# Altium schematic sheet Connectors_Clone.SchDoc: Connectors
size A3; Date: Not used; ApprovedBy: Not used; CheckedBy: Not used; Author: Not used; CompanyName: STMicroelectronics; DrawnBy: Not used; Engineer: Not used; Organization: Not used; Address1: Not used; Address2: Not used; Address3: Not used; Address4: Not used; DocumentNumber: 5; Revision: Not used; SheetNumber: 5; SheetTotal: 9; CurrentTime: Not used; CurrentDate: Not used; Time: Not used; DocumentFullPathAndName: Not used; DocumentName: Not used; ModifiedDate: Not used; ImagePath: Not used; ProjectName: Not used; Application_BuildNumber: Not used
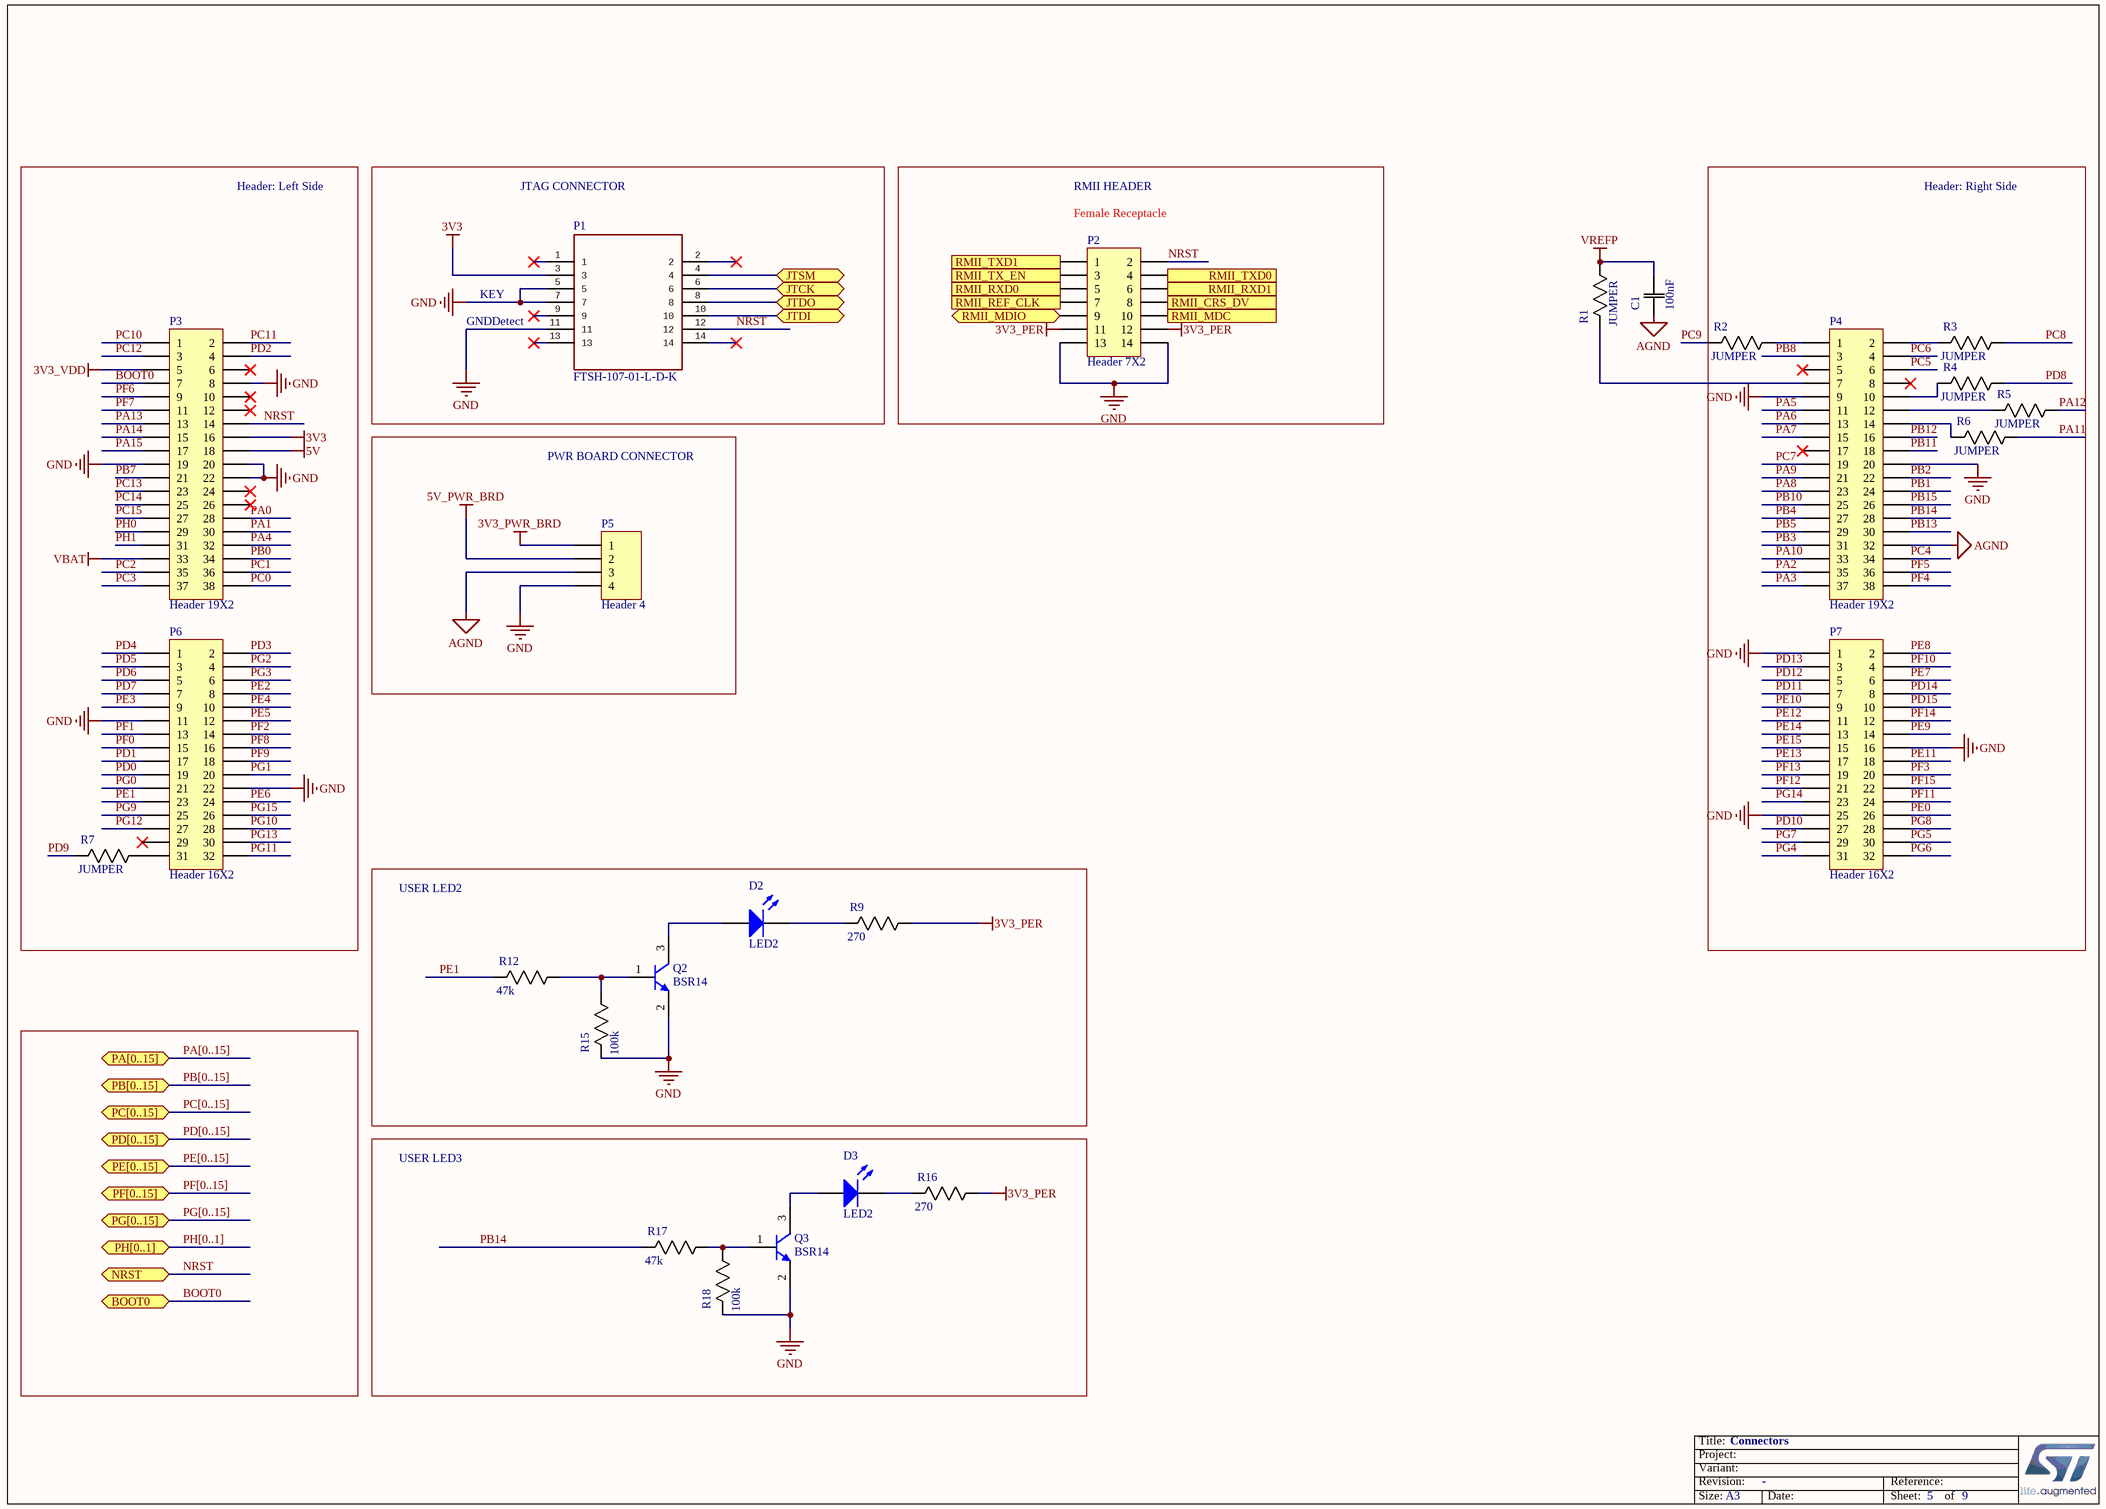
[diagram p0: Connectors_Clone.SchDoc]

## Parts
C1  100nF  [0805]
D2  LED2  [3.2X1.6X1.1]
D3  LED2  [3.2X1.6X1.1]
P1  FTSH-107-01-L-D-K  [CN HDR JTAG]
P2  Header 7X2  [HDR2X7]
P3  Header 19X2  [HDR2X19]
P4  Header 19X2  [HDR2X19]
P5  Header 4  [HDR1X4]
P6  Header 16X2  [HDR2X16]
P7  Header 16X2  [HDR2X16]
Q2  BSR14  [ONSC-SOT-23-3-318-08_V]
Q3  BSR14  [ONSC-SOT-23-3-318-08_V]
R1  JUMPER  [0805]
R2  JUMPER  [0805]
R3  JUMPER  [0805]
R4  JUMPER  [0805]
R5  JUMPER  [0805]
R6  JUMPER  [0805]
R7  JUMPER  [0805]
R9  270  [0805]
R12  47k  [0805]
R15  100k  [0805]
R16  270  [0805]
R17  47k  [0805]
R18  100k  [0805]

## Blocks framed on the sheet
Header: Left Side: P3 P6 R7
Header: Right Side: P4 P7 R2-R6
PWR BOARD CONNECTOR: P5
USER LED2: D2 Q2 R9 R12 R15
USER LED3: D3 Q3 R16-R18

## Ports
BOOT0 (bidir), JTCK (bidir), JTDI (bidir), JTDO (bidir), JTSM (bidir), NRST (bidir), PA[0..15] (bidir), PB[0..15] (bidir), PC[0..15] (bidir), PD[0..15] (bidir), PE[0..15] (bidir), PF[0..15] (bidir), PG[0..15] (bidir), PH[0..1] (bidir), RMII_CRS_DV (out), RMII_MDC (in), RMII_MDIO (bidir), RMII_REF_CLK (in), RMII_RXD0 (out), RMII_RXD1 (out), RMII_TX_EN (in), RMII_TXD0 (in), RMII_TXD1 (in)

## Nets
3V3: P1.3 P3.16
3V3_PER: P2.11 P2.12 R9.1(R1) R16.1(R1)
3V3_PWR_BRD: P5.1
3V3_VDD: P3.5
5V: P3.18
5V_PWR_BRD: P5.2
AGND: C1.1(C1) P4.32 P5.3
GND: P1.5 P1.7 P1.11 P2.13 P2.14 P3.8 P3.19 P3.20 P3.22 P4.9 P4.20 P5.4 P6.11 P6.22 P7.1 P7.16 P7.25 Q2.2(E) Q3.2(E) R15.2(R2) R18.2(R2)
VBAT: P3.33
VREFP: C1.2(C2) R1.1(R1)
BOOT0: P3.7 ; port BOOT0
JTCK: P1.6 ; port JTCK
JTDI: P1.10 ; port JTDI
JTDO: P1.8 ; port JTDO
JTSM: P1.4 ; port JTSM
NRST: P1.12 P2.2 P3.14 ; port NRST
PA0: P3.28
PA1: P3.30
PA2: P4.35
PA3: P4.37
PA4: P3.32
PA5: P4.11
PA6: P4.13
PA7: P4.15
PA8: P4.23
PA9: P4.21
PA10: P4.33
PA11: R6.1(R1)
PA12: R5.1(R1)
PA13: P3.13
PA14: P3.15
PA15: P3.17
PB0: P3.34
PB1: P4.24
PB2: P4.22
PB3: P4.31
PB4: P4.27
PB5: P4.29
PB7: P3.21
PB8: P4.3
PB10: P4.25
PB11: P4.18
PB12: P4.16
PB13: P4.30
PB14: P4.28 R17.2(R2)
PB15: P4.26
PC0: P3.38
PC1: P3.36
PC2: P3.35
PC3: P3.37
PC4: P4.34
PC5: P4.6
PC6: P4.4
PC7: P4.19
PC8: R3.1(R1)
PC9: R2.2(R2)
PC10: P3.1
PC11: P3.2
PC12: P3.3
PC13: P3.23
PC14: P3.25
PC15: P3.27
PD0: P6.19
PD1: P6.17
PD2: P3.4
PD3: P6.2
PD4: P6.1
PD5: P6.3
PD6: P6.5
PD7: P6.7
PD8: R4.1(R1)
PD9: R7.2(R2)
PD10: P7.27
PD11: P7.7
PD12: P7.5
PD13: P7.3
PD14: P7.8
PD15: P7.10
PE0: P7.26
PE1: P6.23 R12.2(R2)
PE2: P6.8
PE3: P6.9
PE4: P6.10
PE5: P6.12
PE6: P6.24
PE7: P7.6
PE8: P7.2
PE9: P7.14
PE10: P7.9
PE11: P7.18
PE12: P7.11
PE13: P7.17
PE14: P7.13
PE15: P7.15
PF0: P6.15
PF1: P6.13
PF2: P6.14
PF3: P7.20
PF4: P4.38
PF5: P4.36
PF6: P3.9
PF7: P3.11
PF8: P6.16
PF9: P6.18
PF10: P7.4
PF11: P7.24
PF12: P7.21
PF13: P7.19
PF14: P7.12
PF15: P7.22
PG0: P6.21
PG1: P6.20
PG2: P6.4
PG3: P6.6
PG4: P7.31
PG5: P7.30
PG6: P7.32
PG7: P7.29
PG8: P7.28
PG9: P6.25
PG10: P6.28
PG11: P6.32
PG12: P6.27
PG13: P6.30
PG14: P7.23
PG15: P6.26
PH0: P3.29
PH1: P3.31
RMII_CRS_DV: P2.8 ; port RMII_CRS_DV
RMII_MDC: P2.10 ; port RMII_MDC
RMII_MDIO: P2.9 ; port RMII_MDIO
RMII_REF_CLK: P2.7 ; port RMII_REF_CLK
RMII_RXD0: P2.5 ; port RMII_RXD0
RMII_RXD1: P2.6 ; port RMII_RXD1
RMII_TX_EN: P2.3 ; port RMII_TX_EN
RMII_TXD0: P2.4 ; port RMII_TXD0
RMII_TXD1: P2.1 ; port RMII_TXD1
NetD2_1: D2.1(A) Q2.3(C)
NetD2_2: D2.2(K) R9.2(R2)
NetD3_1: D3.1(A) Q3.3(C)
NetD3_2: D3.2(K) R16.2(R2)
NetP4_1: P4.1 R2.1(R1)
NetP4_2: P4.2 R3.2(R2)
NetP4_7: P4.7 R1.2(R2)
NetP4_10: P4.10 R4.2(R2)
NetP4_12: P4.12 R5.2(R2)
NetP4_14: P4.14 R6.2(R2)
NetP6_31: P6.31 R7.1(R1)
NetQ2_1: Q2.1(B) R12.1(R1) R15.1(R1)
NetQ3_1: Q3.1(B) R17.1(R1) R18.1(R1)

Not connected (* = marked no-connect by the designer): P1 1* 2* 9* 13* 14*; P3 6* 10* 12* 24* 26*; P4 5* 8* 17*; P6 29*

## Buses and harness runs
bus PA[0..15] = port PA[0..15]
bus PB[0..15] = port PB[0..15]
bus PC[0..15] = port PC[0..15]
bus PD[0..15] = port PD[0..15]
bus PE[0..15] = port PE[0..15]
bus PF[0..15] = port PF[0..15]
bus PG[0..15] = port PG[0..15]
bus PH[0..1] = port PH[0..1]

## Notes on the sheet
- JTAG CONNECTOR
- RMII HEADER
- (near P2) Female Receptacle
- KEY
- (near P1) GNDDetect
- Title:
- Project:
- Size:
- Revision:
- Variant:
- A3
- -
- Date:
- Reference:
- Sheet:
- of

## Library data of the parts
C1 = CAP 100nF 0805: CAP CER 0.1UF 50V X7R 0805; MP: CC0805KRX7R9BB104; MF: Yageo; Tolerance: 10%; Package: 0805; Price: 0,119 CAD; Value: 100nF; Digikey: 311-1140-1-ND; Digikey Link: https://www.digikey.ca/products/en?keywords=311-1140-1-ND; Rating: 50V
D2 = LED GREEN SMD: Typical RED, GREEN, YELLOW, AMBER GaAs LED; MF: Lite-On Inc.; MP: LTST-C191KGKT; Rating: 2V; Digikey: 160-1446-1-ND; Digikey Link: https://www.digikey.ca/products/en?keywords=160-1446-1-ND; Package: 0603
D3 = LED RED SMD: Typical RED, GREEN, YELLOW, AMBER GaAs LED; MF: Lite-On Inc.; MP: LTST-C190CKT; Rating: 1.8V; Digikey: 160-1181-1-ND; Digikey Link: https://www.digikey.ca/products/en?keywords=160-1181-1-ND; Package: 0603
P1 = CN HDR JTAG: Connector Header Through Hole 14 position 0.050" (1.27mm); MF: Samtec Inc.; Rating: 3.4A; ComponentLink1Description: Digikey; ComponentLink1URL: https://www.digikey.ca/product-detail/en/samtec-inc/FTSH-107-01-L-D-K/612-FTSH-107-01-L-D-K-ND/6693516; ComponentLink2Description: Datasheet; ComponentLink2URL: https://www.digikey.ca/en/datasheets/samtecinc/samtec-inc-ftsh-1xx-xx-xx-d-xx-xx-mkt; Digikey: 612-FTSH-107-01-L-D-K-ND; Digikey Link: https://www.digikey.ca/product-detail/en/samtec-inc/FTSH-107-01-L-D-K/612-FTSH-107-01-L-D-K-ND/6693516; MP: FTSH-107-01-L-D-K; Price: 5.14000 CAD
P2 = Header 7X2: Header, 7-Pin, Dual row; LatestRevisionDate: 17-Jul-2002; LatestRevisionNote: Re-released for DXP Platform.; Publisher: Altium Limited
P3 P4 = Header 19X2: Header, 19-Pin, Dual row; LatestRevisionDate: 17-Jul-2002; LatestRevisionNote: Re-released for DXP Platform.; Publisher: Altium Limited
P5 = Header 4: Header, 4-Pin; LatestRevisionDate: 17-Jul-2002; LatestRevisionNote: Re-released for DXP Platform.; Publisher: Altium Limited
P6 P7 = Header 16X2: Header, 16-Pin, Dual row; LatestRevisionDate: 17-Jul-2002; LatestRevisionNote: Re-released for DXP Platform.; Publisher: Altium Limited
Q2 Q3 = CMP-1048-00605-1: Bipolar (BJT) Transistor NPN 40V 800mA 300MHz 350mW Surface Mount SOT-23-3; ComponentLink1Description: Manufacturer URL; ComponentLink3Description: Package Specification; ComponentLink2URL: http://www.onsemi.com/pub_link/Collateral/BSS64LT1-D.PDF; ComponentLink1URL: http://www.onsemi.com/; ComponentLink2Description: Datasheet; ComponentLink3URL: http://www.onsemi.cn/pub_link/Collateral/318-08.PDF; Digikey: BSR14TR-ND
R1-R7 = RES 0 0805: RES SMD 0 OHM JUMPER 1/8W 0805; MP: RC0805JR-070RL; MF: Yageo; Value: 0; Rating: 0.125W; Digikey: 311-0.0ARCT-ND; Price: 0.058 CAD; Package: 0805; Digikey Link: https://www.digikey.ca/products/en?keywords=311-0.0ARCT-ND
R9 R16 = RES 270 0805: RES SMD 270 OHM 5% 1/8W 0805; MP: RC0805JR-07270RL; MF: Yageo; Rating: 0.125W; Digikey: 311-270ARCT-ND; Price: 0.054 CAD; Package: 0805; Value: 270; Digikey Link: https://www.digikey.ca/product-detail/en/yageo/RC0805JR-07270RL/311-270ARCT-ND/731238
R12 R17 = RES 47k 0805: RES SMD 47K OHM 1% 1/8W 0805; MP: RC0805FR-0747KL; MF: Yageo; Rating: 0.125W; Digikey: 311-47.0KCRCT-ND; Price: 0.061 CAD; Package: 0805; Value: 47k; Digikey Link: https://www.digikey.ca/product-detail/en/yageo/RC0805FR-0747KL/311-47.0KCRCT-ND/730920; Tolerance: 1%
R15 R18 = RES 100k 0805: RES SMD 100K OHM 1% 1/8W 0805; MP: RC0805FR-07100KL; MF: Yageo; Rating: 0.125W; Digikey: 311-100KCRCT-ND; Price: 0.058 CAD; Package: 0805; Value: 100k; Digikey Link: https://www.digikey.ca/products/en?keywords=311-100KCRCT-ND; Tolerance: 1%